# EAGLE design 1_Main (EAGLE 7.7.0)
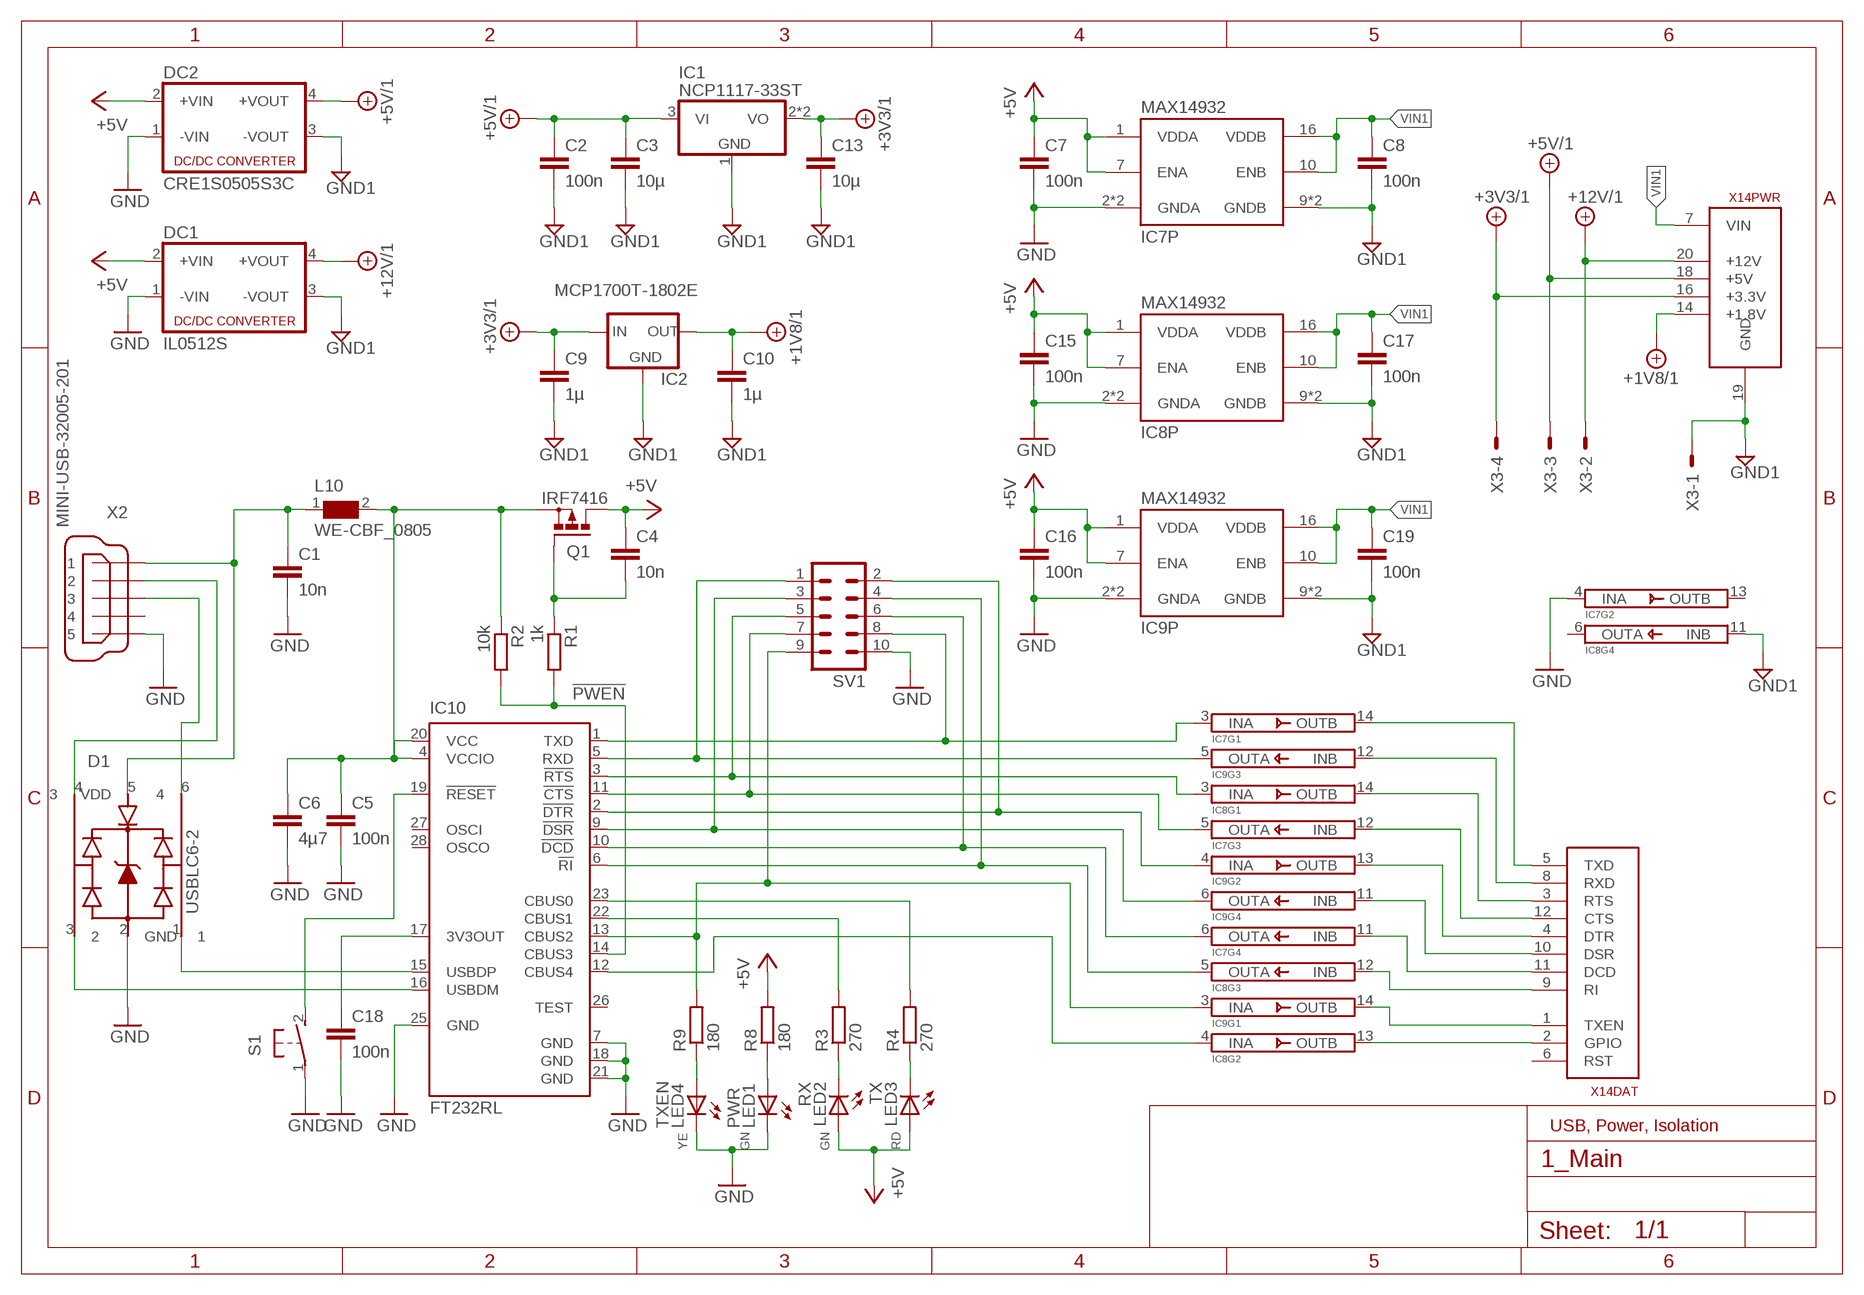
[diagram p0: schematic, sheet 1]

## Parts
C1  10n  C-EUC0805  [C0805]
C2  100n  C-EUC0805  [C0805]
C3  10µ  C-EUC0805  [C0805]
C4  10n  C-EUC0805  [C0805]
C5  100n  C-EUC0805  [C0805]
C6  4µ7  C-EUC0805  [C0805]
C7  100n  C-EUC0805  [C0805]
C8  100n  C-EUC0805  [C0805]
C9  1µ  C-EUC0805  [C0805]
C10  1µ  C-EUC0805  [C0805]
C13  10µ  C-EUC0805  [C0805]
C15  100n  C-EUC0805  [C0805]
C16  100n  C-EUC0805  [C0805]
C17  100n  C-EUC0805  [C0805]
C18  100n  C-EUC0805  [C0805]
C19  100n  C-EUC0805  [C0805]
D1  USBLC6-2  WE-TVS_82400102  [WE-TVS_SOT23-6L]
DC1  IL0512S  NME  [NME]
DC2  CRE1S0505S3C  NME  [NME]
IC1  NCP1117-33ST  [SOT223]
IC2  MCP1700T-1802E  MCP170X  [SOT23]
IC7  MAX14932  [SO16]
IC8  MAX14932  [SO16]
IC9  MAX14932  [SO16]
IC10  FT232RL  [SSOP28]
L10  WE-CBF_0805  [0805]
LED1  PWR  LEDCHIPLED_0603  [CHIPLED_0603]
LED2  RX  LEDCHIPLED_0603  [CHIPLED_0603]
LED3  TX  LEDCHIPLED_0603  [CHIPLED_0603]
LED4  TXEN  LEDCHIPLED_0603  [CHIPLED_0603]
Q1  IRF7416  P-MOSFET-SO8  [SO-08]
R1  1k  R-EU_R0805  [R0805]
R2  10k  R-EU_R0805  [R0805]
R3  270  R-EU_R0805  [R0805]
R4  270  R-EU_R0805  [R0805]
R8  180  R-EU_R0805  [R0805]
R9  180  R-EU_R0805  [R0805]
S1  31-XX  [B3F-31XX]
SV1  ML10  [ML10]
X2  MINI-USB-32005-201  [32005-201]
X3  AKL18X-04W  [AKL182-04]
X14  ALLSERIALMM  [MAIN-THT]

## Nets
!PWEN: IC10.14(CBUS3) R1.2 R2.2
+1V8/1: C10.1 IC2.2(OUT) X14.14(PWR:+1.8V)
+3V3/1: C9.1 C13.1 IC1.2(VO) IC1.4(VO) IC2.3(IN) X3.P$4 X14.16(PWR:+3.3V)
+5V: C4.1 C7.1 C15.1 C16.1 DC1.2(+VIN) DC2.2(+VIN) IC7.1(P:VDDA) IC7.7(P:ENA) IC8.1(P:VDDA) IC8.7(P:ENA) IC9.1(P:VDDA) IC9.7(P:ENA) LED2.A LED3.A Q1.5(D) Q1.6(D) Q1.7(D) Q1.8(D) R8.2
+5V/1: C2.1 C3.1 DC2.4(+VOUT) IC1.3(VI) X3.P$3 X14.18(PWR:+5V)
+12V/1: DC1.4(+VOUT) X3.P$2 X14.20(PWR:+12V)
GND: C1.2 C5.2 C6.2 C7.2 C15.2 C16.2 C18.2 D1.2(GND) DC1.1(-VIN) DC2.1(-VIN) IC7.2(P:GNDA) IC7.4(INA) IC7.8(P:GNDA) IC8.2(P:GNDA) IC8.8(P:GNDA) IC9.2(P:GNDA) IC9.8(P:GNDA) IC10.7(GND) IC10.18(GND) IC10.21(GND) IC10.25(GND) LED1.C LED4.C S1.1(P) SV1.10 X2.5
GND1: C2.2 C3.2 C8.2 C9.2 C10.2 C13.2 C17.2 C19.2 DC1.3(-VOUT) DC2.3(-VOUT) IC1.1(GND) IC2.1(GND) IC7.9(P:GNDB) IC7.15(P:GNDB) IC8.9(P:GNDB) IC8.11(INB) IC8.15(P:GNDB) IC9.9(P:GNDB) IC9.15(P:GNDB) X3.P$1 X14.19(PWR:GND)
N$1: IC9.5(OUTA) IC10.5(RXD) SV1.1
N$2: IC9.6(OUTA) IC10.9(!DSR) SV1.3
N$3: IC9.3(INA) IC10.13(CBUS2) R9.2 SV1.9
N$4: LED3.C R4.1
N$5: IC10.19(!RESET) S1.2(S)
N$6: LED2.C R3.1
N$7: LED4.A R9.1
N$8: LED1.A R8.1
N$9: D1.3 IC10.16(USBDM)
N$10: D1.1 IC10.15(USBDP)
N$11: C1.1 D1.5(VDD) L10.1 X2.1
N$12: D1.4 X2.2
N$13: IC8.4(INA) IC10.12(CBUS4)
N$14: IC7.3(INA) IC10.1(TXD) SV1.8
N$15: D1.6 X2.3
N$22: C18.1 IC10.17(3V3OUT)
N$29: IC8.3(INA) IC10.3(!RTS) SV1.5
N$32: IC7.5(OUTA) IC10.11(!CTS) SV1.7
N$33: IC9.4(INA) IC10.2(!DTR) SV1.2
N$35: IC7.6(OUTA) IC10.10(!DCD) SV1.6
N$36: IC8.5(OUTA) IC10.6(!RI) SV1.4
N$38: C5.1 C6.1 IC10.4(VCCIO) IC10.20(VCC) L10.2 Q1.1(S) Q1.2(S) Q1.3(S) R2.1
N$42: C4.2 Q1.4(G) R1.1
N$80: IC7.14(OUTB) X14.5(DAT:TXD)
N$81: IC9.12(INB) X14.8(DAT:RXD)
N$82: IC8.14(OUTB) X14.3(DAT:RTS)
N$83: IC7.12(INB) X14.12(DAT:CTS)
N$84: IC9.13(OUTB) X14.4(DAT:DTR)
N$85: IC9.11(INB) X14.10(DAT:DSR)
N$86: IC7.11(INB) X14.11(DAT:DCD)
N$87: IC8.12(INB) X14.9(DAT:RI)
N$88: IC9.14(OUTB) X14.1(DAT:TXEN)
N$89: IC8.13(OUTB) X14.2(DAT:GPIO)
RXLED: IC10.22(CBUS1) R3.2
TXLED: IC10.23(CBUS0) R4.2
VIN1: C8.1 C17.1 C19.1 IC7.10(P:ENB) IC7.16(P:VDDB) IC8.10(P:ENB) IC8.16(P:VDDB) IC9.10(P:ENB) IC9.16(P:VDDB) X14.7(PWR:VIN)
Unconnected: IC7.13(OUTB) IC8.6(OUTA) IC10.26(TEST) IC10.27(OSCI) IC10.28(OSCO) X2.4 X14.6(DAT:RST) X14.13(USB:VUSB) X14.15(USB:D+) X14.17(USB:D-)

## Notes on the sheet
- USB, Power, Isolation

## Library data of the parts
C1-C10 C13 C15-C19 = rcl:C-EU: CAPACITOR, European symbol
D1 = EagleLibrary_Wuerth_Elektronik_eiSos_Version_6-9:WE-TVS_82400102: TVS Diode Array WE-TVS, High Speed Series - Low capazity - No leakage current - Low clamping voltage - high ESD voltage protection -- USB 1.0 - 2.0 Flow Thru Design
DC1 DC2 = dc-dc-converter:NME: DC-DC CONVERTER; MF: C & D TECHNOLOGIES, INC; MPN: NME1205D; OC_FARNELL: 1021466; OC_NEWARK: 98B8198
IC1 = linear:NCP1117
IC2 = SeeSys:MCP170X
IC7-IC9 = max14932:MAX14932
IC10 = ftdichip:FT232R: Source: http://www.ftdichip.com/Documents/DataSheets/DS_FT232R_v104.pdf; MPN: FT232RL; OC_FARNELL: 1146032; OC_NEWARK: 91K9918
L10 = EagleLibrary_Wuerth_Elektronik_eiSos_Version_6-12:WE-CBF: SMD EMI Suppression Ferrite Beads WE-CBF - Excellent anti-EMI properties - Low DC-restistance - Impedances till 3000 ohms - Rated current up to 6 A -- Reliable Ni-Sn electrodes -- Perfect as data lined filter and for uncoupling of distribution voltage
LED1 LED2 = led:LED: LED OSRAM: - CHIPLED LG R971, LG N971, LY N971, LG Q971, LY Q971, LO R971, LY R971 LH N974, LH R974 LS Q976, LO Q976, LY Q976 LO Q996 - Hyper CHIPLED LW Q18S LB Q993, LB Q99A, LB R99A - SideLED LS A670, LO A670, LY A670, LG A670, LP A670 LB A673, LV A673, LT A673, LW A673 LH A674 LY A675 LS A676, LA A676, LO A676, LY A676, LW A676 LS A679, LY A679, LG A679 - Hyper Micro SIDELED® LS Y876, LA Y876, LO Y876, LY Y876 LT Y87S - SmartLED LW L88C, LW L88S LB L89C, LB L89S, LG L890 LS L89K, LO L89K, LY L89K LS L896, LA L896, LO L896, LY L896 - TOPLED LS T670, LO T670, LY T670, LG T670, LP T670 LSG T670, LSP T670, LSY T670, LOP T670, LYG T670 LG T671, LOG T671, LSG T671 LB T673, LV T673, LT T673, LW T673 LH T674 LS T676, LA T676, LO T676, LY T676, LB T676, LH T676, LSB T676, LW T676 LB T67C, LV T67C, LT T67C, LS T67K, LO T67K, LY T67K, LW E67C LS E67B, LA E67B, LO E67B, LY E67B, LB E67C, LV E67C, LT E67C LW T67C LS T679, LY T679, LG T679 LS T770, LO T770, LY T770, LG T770, LP T770 LB T773, LV T773, LT T773, LW T773 LH T774 LS E675, LA E675, LY E675, LS T675 LS T776, LA T776, LO T776, LY T776, LB T776 LHGB T686 LT T68C, LB T68C - Hyper Mini TOPLED® LB M676 - Mini TOPLED Santana® LG M470 LS M47K, LO M47K, LY M47K Source: http://www.osram.convergy.de LUXEON: - LUMILED® LXK2-PW12-R00, LXK2-PW12-S00, LXK2-PW14-U00, LXK2-PW14-V00 LXK2-PM12-R00, LXK2-PM12-S00, LXK2-PM14-U00 LXK2-PE12-Q00, LXK2-PE12-R00, LXK2-PE12-S00, LXK2-PE14-T00, LXK2-PE14-U00 LXK2-PB12-K00, LXK2-PB12-L00, LXK2-PB12-M00, LXK2-PB14-N00, LXK2-PB14-P00, LXK2-PB14-Q00 LXK2-PR12-L00, LXK2-PR12-M00, LXK2-PR14-Q00, LXK2-PR14-R00 LXK2-PD12-Q00, LXK2-PD12-R00, LXK2-PD12-S00 LXK2-PH12-R00, LXK2-PH12-S00 LXK2-PL12-P00, LXK2-PL12-Q00, LXK2-PL12-R00 Source: www.luxeon.com KINGBRIGHT: KA-3528ASYC Source: www.kingbright.com; COLOR: GN
LED3 = led:LED: LED OSRAM: - CHIPLED LG R971, LG N971, LY N971, LG Q971, LY Q971, LO R971, LY R971 LH N974, LH R974 LS Q976, LO Q976, LY Q976 LO Q996 - Hyper CHIPLED LW Q18S LB Q993, LB Q99A, LB R99A - SideLED LS A670, LO A670, LY A670, LG A670, LP A670 LB A673, LV A673, LT A673, LW A673 LH A674 LY A675 LS A676, LA A676, LO A676, LY A676, LW A676 LS A679, LY A679, LG A679 - Hyper Micro SIDELED® LS Y876, LA Y876, LO Y876, LY Y876 LT Y87S - SmartLED LW L88C, LW L88S LB L89C, LB L89S, LG L890 LS L89K, LO L89K, LY L89K LS L896, LA L896, LO L896, LY L896 - TOPLED LS T670, LO T670, LY T670, LG T670, LP T670 LSG T670, LSP T670, LSY T670, LOP T670, LYG T670 LG T671, LOG T671, LSG T671 LB T673, LV T673, LT T673, LW T673 LH T674 LS T676, LA T676, LO T676, LY T676, LB T676, LH T676, LSB T676, LW T676 LB T67C, LV T67C, LT T67C, LS T67K, LO T67K, LY T67K, LW E67C LS E67B, LA E67B, LO E67B, LY E67B, LB E67C, LV E67C, LT E67C LW T67C LS T679, LY T679, LG T679 LS T770, LO T770, LY T770, LG T770, LP T770 LB T773, LV T773, LT T773, LW T773 LH T774 LS E675, LA E675, LY E675, LS T675 LS T776, LA T776, LO T776, LY T776, LB T776 LHGB T686 LT T68C, LB T68C - Hyper Mini TOPLED® LB M676 - Mini TOPLED Santana® LG M470 LS M47K, LO M47K, LY M47K Source: http://www.osram.convergy.de LUXEON: - LUMILED® LXK2-PW12-R00, LXK2-PW12-S00, LXK2-PW14-U00, LXK2-PW14-V00 LXK2-PM12-R00, LXK2-PM12-S00, LXK2-PM14-U00 LXK2-PE12-Q00, LXK2-PE12-R00, LXK2-PE12-S00, LXK2-PE14-T00, LXK2-PE14-U00 LXK2-PB12-K00, LXK2-PB12-L00, LXK2-PB12-M00, LXK2-PB14-N00, LXK2-PB14-P00, LXK2-PB14-Q00 LXK2-PR12-L00, LXK2-PR12-M00, LXK2-PR14-Q00, LXK2-PR14-R00 LXK2-PD12-Q00, LXK2-PD12-R00, LXK2-PD12-S00 LXK2-PH12-R00, LXK2-PH12-S00 LXK2-PL12-P00, LXK2-PL12-Q00, LXK2-PL12-R00 Source: www.luxeon.com KINGBRIGHT: KA-3528ASYC Source: www.kingbright.com; COLOR: RD
LED4 = led:LED: LED OSRAM: - CHIPLED LG R971, LG N971, LY N971, LG Q971, LY Q971, LO R971, LY R971 LH N974, LH R974 LS Q976, LO Q976, LY Q976 LO Q996 - Hyper CHIPLED LW Q18S LB Q993, LB Q99A, LB R99A - SideLED LS A670, LO A670, LY A670, LG A670, LP A670 LB A673, LV A673, LT A673, LW A673 LH A674 LY A675 LS A676, LA A676, LO A676, LY A676, LW A676 LS A679, LY A679, LG A679 - Hyper Micro SIDELED® LS Y876, LA Y876, LO Y876, LY Y876 LT Y87S - SmartLED LW L88C, LW L88S LB L89C, LB L89S, LG L890 LS L89K, LO L89K, LY L89K LS L896, LA L896, LO L896, LY L896 - TOPLED LS T670, LO T670, LY T670, LG T670, LP T670 LSG T670, LSP T670, LSY T670, LOP T670, LYG T670 LG T671, LOG T671, LSG T671 LB T673, LV T673, LT T673, LW T673 LH T674 LS T676, LA T676, LO T676, LY T676, LB T676, LH T676, LSB T676, LW T676 LB T67C, LV T67C, LT T67C, LS T67K, LO T67K, LY T67K, LW E67C LS E67B, LA E67B, LO E67B, LY E67B, LB E67C, LV E67C, LT E67C LW T67C LS T679, LY T679, LG T679 LS T770, LO T770, LY T770, LG T770, LP T770 LB T773, LV T773, LT T773, LW T773 LH T774 LS E675, LA E675, LY E675, LS T675 LS T776, LA T776, LO T776, LY T776, LB T776 LHGB T686 LT T68C, LB T68C - Hyper Mini TOPLED® LB M676 - Mini TOPLED Santana® LG M470 LS M47K, LO M47K, LY M47K Source: http://www.osram.convergy.de LUXEON: - LUMILED® LXK2-PW12-R00, LXK2-PW12-S00, LXK2-PW14-U00, LXK2-PW14-V00 LXK2-PM12-R00, LXK2-PM12-S00, LXK2-PM14-U00 LXK2-PE12-Q00, LXK2-PE12-R00, LXK2-PE12-S00, LXK2-PE14-T00, LXK2-PE14-U00 LXK2-PB12-K00, LXK2-PB12-L00, LXK2-PB12-M00, LXK2-PB14-N00, LXK2-PB14-P00, LXK2-PB14-Q00 LXK2-PR12-L00, LXK2-PR12-M00, LXK2-PR14-Q00, LXK2-PR14-R00 LXK2-PD12-Q00, LXK2-PD12-R00, LXK2-PD12-S00 LXK2-PH12-R00, LXK2-PH12-S00 LXK2-PL12-P00, LXK2-PL12-Q00, LXK2-PL12-R00 Source: www.luxeon.com KINGBRIGHT: KA-3528ASYC Source: www.kingbright.com; COLOR: YE
Q1 = transistor-power:P-MOSFET-SO8: P-Channel MOSFET Example: FDS4435A; P-Channel Logic Level PowerTrench® MOSFET FDS4465; P-Channel 1.8V Specified PowerTrench® MOSFET Source: www.fairchildsemi.com
R1-R4 R8 R9 = rcl:R-EU_: RESISTOR, European symbol
S1 = switch-omron:31-XX: OMRON SWITCH; MPN: B3F-3100; OC_FARNELL: 959704; OC_NEWARK: 36M3582
SV1 = con-harting-ml:ML10: HARTING; OC_FARNELL: unknown; OC_NEWARK: unknown
X2 = con-cypressindustries:MINI-USB-: MINI USB-B Conector Source: www.cypressindustries.com; OC_FARNELL: unknown; OC_NEWARK: unknown
X3 = con-riacon_akl:AKL18X-04: Riacon AKL18X Steckverbinder 4-Pol Grid = 3,5mm
X14 = AllSerial:ALLSERIAL

## Board
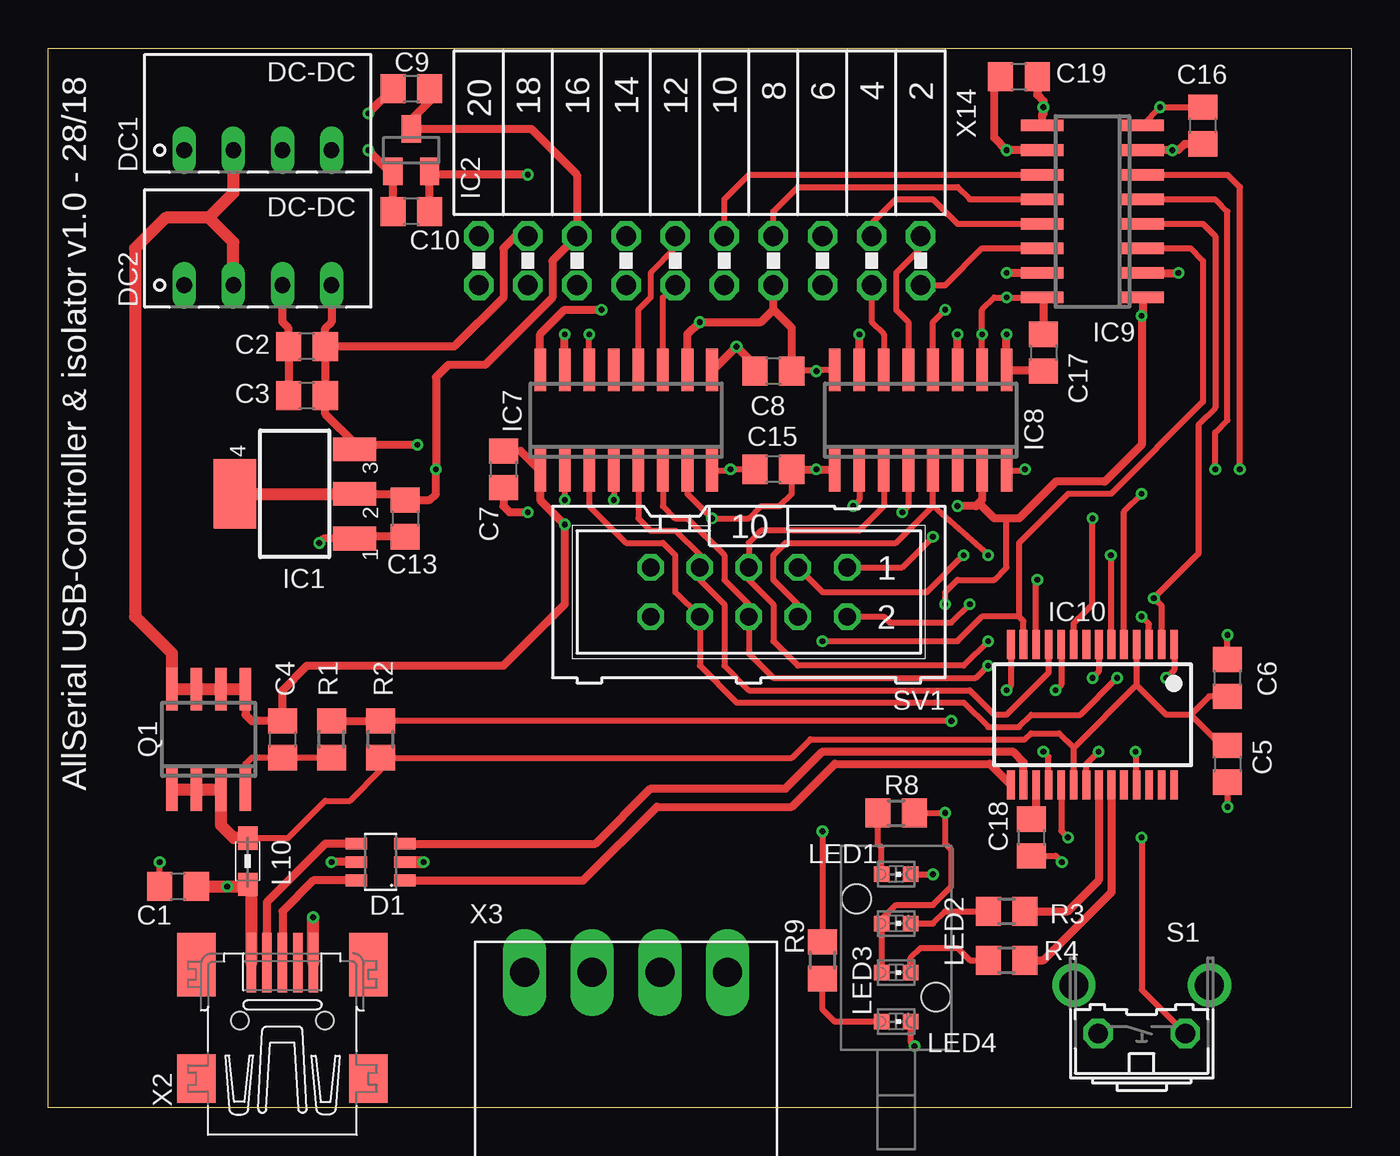
[diagram p1: board, top side]
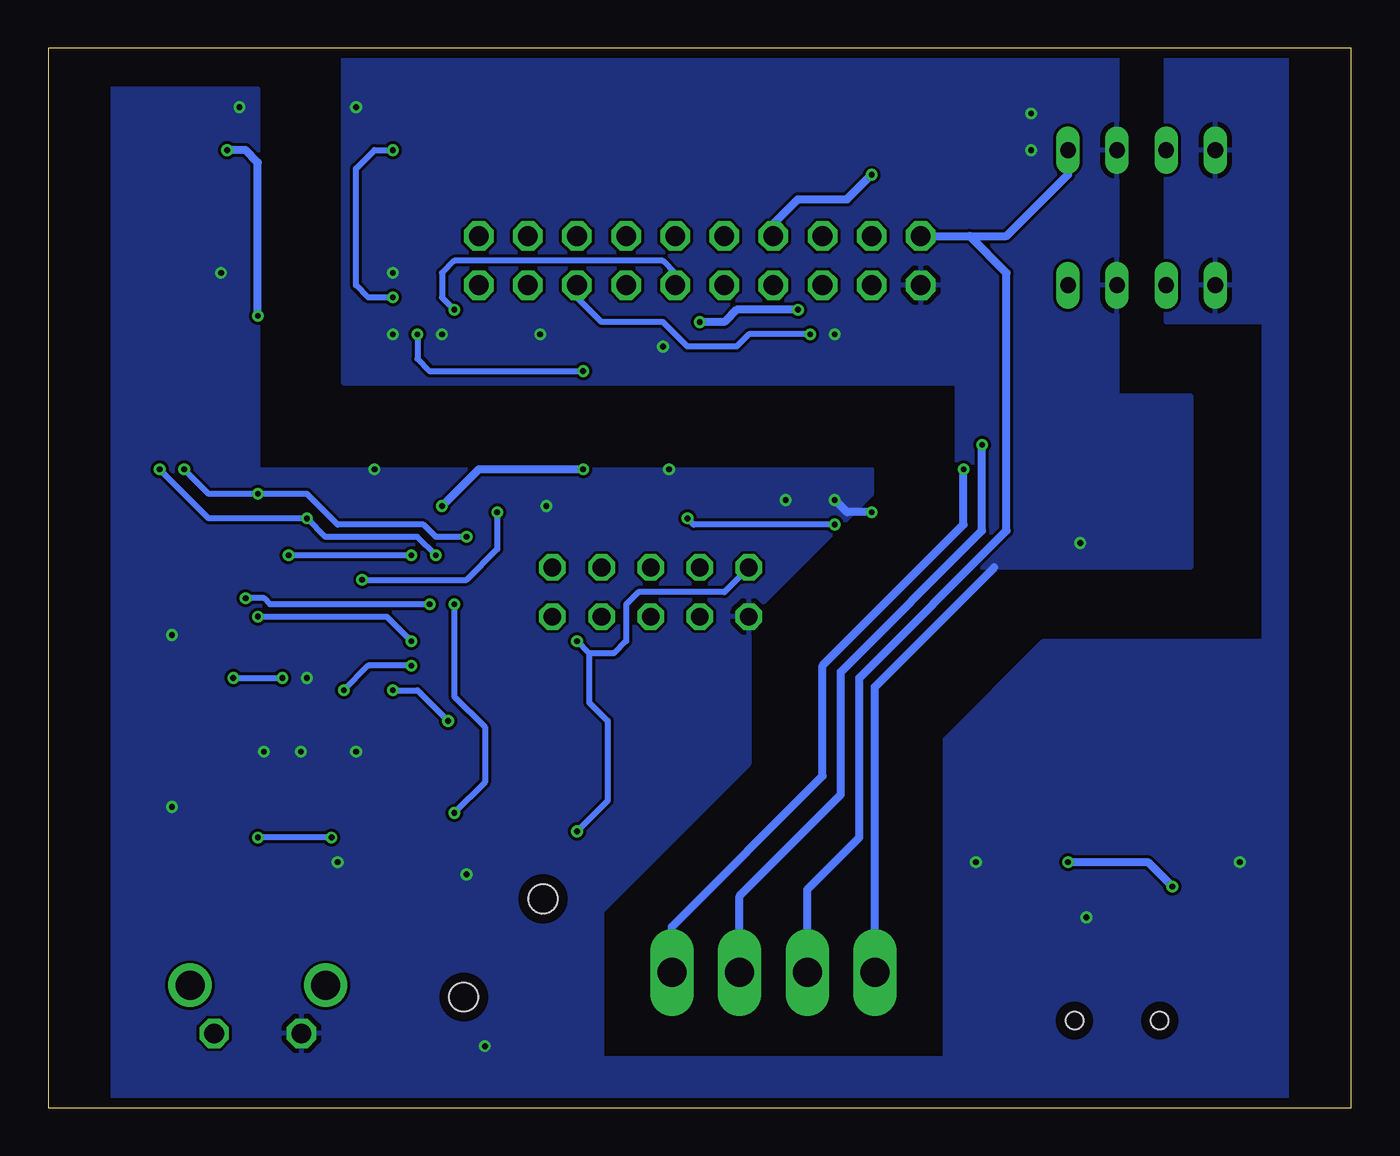
[diagram p2: board, bottom side, seen from below]

Size 67.4 x 54.8 mm. Coordinates in mm from the lower left corner, seen from the top.
Copper layers (1*16): Top 0.035mm / dielectric 1.6mm / Bottom 0.035mm
Design rules "Elecrow_2-layer_PCB_eagle_rule *": minimum track width 6mil, minimum drill 0.3mm, track to track 6mil, track to pad 6mil, pad to pad 6mil, via to via 8mil, smd to smd 0mil, copper to edge 20mil, drill to drill 10mil, minimum pad ring 6mil, minimum via ring 6mil, stop-mask expansion 0mil, vias tented up to drill 100mil, thermal gap 10mil

### Footprints (pad centres in the part's own frame; a part is rotated, then mirrored left to right if it is on the bottom)
C0805 = smd 1.3 x 1.5: 1 -0.95,0; 2 0.95,0
WE-TVS_SOT23-6L = smd 0.6 x 1.1: 1 -0.95,-1.25; 2 0,-1.25; 3 0.95,-1.25; 4 0.95,1.25; 5 0,1.25; 6 -0.95,1.25
NME = drill 0.813 long: 1 0,3.81; 2 0,1.27; 3 0,-1.27; 4 0,-3.81
SOT223 = smd 1.219 x 2.235: 1 -2.311,-3.099; 2 0,-3.099; 3 2.311,-3.099 | smd 3.6 x 2.2: 4 0,3.099
SOT23 = smd 1 x 1.4: 1 -0.95,-1.1; 2 0.95,-1.1; 3 0,1.1
SO16 = smd 0.6 x 2.2: 1 -4.445,-2.6; 2 -3.175,-2.6; 3 -1.905,-2.6; 4 -0.635,-2.6; 5 0.635,-2.6; 6 1.905,-2.6; 7 3.175,-2.6; 8 4.445,-2.6; 9 4.445,2.6; 10 3.175,2.6; 11 1.905,2.6; 12 0.635,2.6; 13 -0.635,2.6; 14 -1.905,2.6; 15 -3.175,2.6; 16 -4.445,2.6
SSOP28 = smd 0.4 x 1.5: 1 -4.225,-3.625; 2 -3.575,-3.625; 3 -2.925,-3.625; 4 -2.275,-3.625; 5 -1.625,-3.625; 6 -0.975,-3.625; 7 -0.325,-3.625; 8 0.325,-3.625; 9 0.975,-3.625; 10 1.625,-3.625; 11 2.275,-3.625; 12 2.925,-3.625; 13 3.575,-3.625; 14 4.225,-3.625; 15 4.225,3.625; 16 3.575,3.625; 17 2.925,3.625; 18 2.275,3.625; 19 1.625,3.625; 20 0.975,3.625; 21 0.325,3.625; 22 -0.325,3.625; 23 -0.975,3.625; 24 -1.625,3.625; 25 -2.275,3.625; 26 -2.925,3.625; 27 -3.575,3.625; 28 -4.225,3.625
0805 = smd 1.2 x 1: 1 -1.2,0; 2 1.2,0
CHIPLED_0603 = smd 0.8 x 0.8: A 0,-0.75; C 0,0.75
SO-08 = smd 0.6 x 2.2: 1 -1.905,-2.6; 2 -0.635,-2.6; 3 0.635,-2.6; 4 1.905,-2.6; 5 1.905,2.6; 6 0.635,2.6; 7 -0.635,2.6; 8 -1.905,2.6
R0805 = smd 1.3 x 1.5: 1 -0.95,0; 2 0.95,0
B3F-31XX = drill 1.016 octagon: 1 -2.261,-1.245; 2 2.261,-1.245 | drill 1.499 pad 2.159: 3 -3.505,1.245; 4 3.505,1.245
ML10 = drill 0.914 octagon: 1 -5.08,-1.27; 2 -5.08,1.27; 3 -2.54,-1.27; 4 -2.54,1.27; 5 0,-1.27; 6 0,1.27; 7 2.54,-1.27; 8 2.54,1.27; 9 5.08,-1.27; 10 5.08,1.27
1296.1004 = hole 1.5: 2.05,-2.54; -2.05,2.54
32005-201 = smd 3.1 x 0.5: 1 3,1.6; 2 3,0.8; 3 3,0; 4 3,-0.8; 5 3,-1.6 | smd 2.5 x 2: M1 -3,-4.45; M2 -3,4.45 | smd 3.3 x 2: M3 2.9,4.45; M4 2.9,-4.45 | hole 0.9: 0,2.2; 0,-2.2
AKL182-04 = drill 1.5 pad 2.184 long: P$1 -5.25,0; P$2 -1.75,0; P$3 1.75,0; P$4 5.25,0
MAIN-THT = drill 1.016 octagon: 1 11.43,42.545; 2 11.43,45.085; 3 8.89,42.545; 4 8.89,45.085; 5 6.35,42.545; 6 6.35,45.085; 7 3.81,42.545; 8 3.81,45.085; 9 1.27,42.545; 10 1.27,45.085; 11 -1.27,42.545; 12 -1.27,45.085; 13 -3.81,42.545; 14 -3.81,45.085; 15 -6.35,42.545; 16 -6.35,45.085; 17 -8.89,42.545; 18 -8.89,45.085; 19 -11.43,42.545; 20 -11.43,45.085

### Placement (x,y rotation side)
C1  6.71,11.43 180 top
C2  13.38,39.37 180 top
C3  13.38,36.83 180 top
C4  12.11,19.05 270 top
C5  61.01,17.78 270 top
C6  61.01,22.23 90 top
C7  23.54,33.02 270 top
C8  37.51,38.1 180 top
C9  18.78,52.7 180 top
C10  18.78,46.35 180 top
C13  18.46,30.48 270 top
C15  37.51,33.02 180 top
C16  59.73,50.8 90 top
C17  51.48,39.05 270 top
C18  50.84,13.97 270 top
C19  50.21,53.34 0 top
D1  17.19,12.7 90 top
DC1  10.84,49.53 90 top
DC2  10.84,42.55 90 top
IC1  12.75,31.75 90 top
IC2  18.78,49.53 0 top
IC7  29.89,35.56 0 top
IC8  45.13,35.56 0 top
IC9  54.02,46.35 90 top
IC10  54.02,20.32 180 top
L10  10.32,12.74 90 top
LED1  43.86,12.06 270 top
LED2  43.86,9.53 270 top
LED3  43.86,6.99 270 top
LED4  43.86,4.45 270 top
Q1  8.3,19.05 0 top
R1  14.65,19.05 90 top
R2  17.19,19.05 90 top
R3  49.58,10.16 0 top
R4  49.58,7.62 0 top
R8  43.86,15.24 0 top
R9  40.05,7.62 90 top
S1  56.56,5.08 0 top
SV1  36.24,26.67 180 top
U$3  [1296.1004]  43.86,8.26 180 top
X2  12.11,4.5 90 top
X3  29.89,6.99 0 top
X14  33.7,0 0 top

### Tracks (layer width: path | path; a pad name or v marks a point on that pad's centre or on a via)
!PWEN  (via drill 0.3)
  Top 0.305: IC10.14 49.8,21.81 v49.58,21.59 | v46.72,20 R2.2
  Top 0.406: R1.2 R2.2
  Bottom 0.305: v49.58,21.59 48.31,21.59 v46.72,20
+1V8/1  (via drill 0.3)
  Top 0.406: C10.1 IC2.2 19.9,48.26 v24.81,48.26
  Bottom 0.406: X14.14 29.89,45.72 28.62,46.99 26.08,46.99 v24.81,48.26
+3V3/1  (via drill 0.3)
  Top 0.406: IC1.2 18.14,31.75 C13.1 19.73,31.43 20.05,31.75 v20.05,33.02 20.05,37.78 20.68,38.42 22.59,38.42 26.08,41.91 26.08,43.81 X14.16 27.35,48.26 24.98,50.63 IC2.3 18.78,51.12 19.73,52.07 C9.1
  Top 0.61: IC1.4 IC1.2
  Bottom 0.406: X3.P$4 35.14,9.36 27.35,17.14 27.35,22.86 20.05,30.16 v20.05,33.02
+5V  (via drill 0.3)
  Top 0.305: IC7.7 33.07,31.75 v34.34,30.48 36.24,30.48 36.88,31.11 37.83,31.11 38.46,31.75 C15.1 | LED3.A LED2.A 43.11,9.73 43.86,10.48 45.77,10.48 46.72,11.43 46.72,13.34 46.4,13.65 v46.4,15.24 R8.2 | v46.4,26.04 46.4,26.67 47.04,27.3 48.94,27.3 49.58,27.94 49.58,30.48
  Top 0.406: Q1.5 10.21,20.32 10.53,20 C4.1 12.11,21.59 13.38,22.86 23.54,22.86 26.72,26.04 v26.72,30.16 25.45,31.43 IC7.1 | C16.1 58.79,49.85 58.47,49.53 v58.15,49.53 IC9.7 | 25.39,33.02 IC7.1 | C15.1 v39.73,33.02 40.62,33.02 IC8.1 | IC8.7 48.31,31.43 48.15,31.27 | 48.15,31.27 47.99,31.11 v47.04,31.11 | IC9.1 56.62,41.02 v56.56,40.96 56.56,34.29 54.66,32.38 52.12,32.38 50.21,30.48 49.58,30.48 48.94,30.48 48.15,31.27 | C7.1 24.44,33.97 IC7.1
  Top 0.61: Q1.5 Q1.6 Q1.7 Q1.8 6.4,23.5 4.49,25.4 4.49,44.45 6.08,46.04 8.3,46.04 | DC1.2 9.57,47.31 8.3,46.04 | DC2.2 9.57,44.77 8.3,46.04
  Bottom 0.305: v26.72,30.16 34.02,30.16 v34.34,30.48 | v46.4,26.04 46.4,21.27 44.81,19.68 44.81,16.83 v46.4,15.24
  Bottom 0.406: v39.73,33.02 45.13,33.02 v47.04,31.11 | v56.56,40.96 56.56,48.9 57.2,49.53 v58.15,49.53
+5V/1  (via drill 0.3)
  Top 0.406: X14.18 24.18,45.09 23.54,44.45 23.54,41.91 21,39.37 C2.1 | IC1.3 16.07,34.29 | 16.07,34.29 v19.1,34.29 | C2.1 C3.1 14.33,35.88 15.92,34.29 16.07,34.29 | DC2.4 14.65,40.64 14.33,40.32 C2.1
  Bottom 0.406: X3.P$3 31.64,10.95 26.4,16.19 26.4,22.54 19.1,29.84 v19.1,34.29
+12V/1
  Bottom 0.406: X3.P$2 28.14,11.28 25.45,13.97 25.45,22.23 17.83,29.84 17.83,43.18 19.73,45.09 | X14.20 19.73,45.09 | 19.73,45.09 17.83,45.09 14.65,48.26 DC1.4
GND  (via drill 0.3)
  Top 0.305: C1.2 v5.76,12.7 | LED4.C 44.61,3.38 v44.81,3.17 | LED1.C v45.77,12.06 | C18.2 52.11,13.02 v52.43,12.7 | C5.2 v61.01,15.56 | C6.2 v61.01,24.45 | IC10.7 54.34,22.55 v54.02,22.23 | IC7.8 35.23,32.96 v35.29,33.02 C15.2 | IC8.2 41.96,31.43 v41.64,31.11 | IC8.8 50.47,32.96 v50.53,33.02 | IC9.8 56.62,50.86 v57.51,51.75 C16.2 | IC10.18 51.75,18.15 v51.48,18.41 | IC10.21 53.7,17.77 v54.34,18.41 | IC10.25 56.3,18.36 v56.24,18.41 | IC7.2 v26.72,31.43 | IC7.4 v29.26,31.43
  Top 0.406: IC9.2 v58.47,43.18 | C7.2 23.54,31.11 23.86,30.8 v24.81,30.8
  Top 0.61: X2.5 v13.71,9.83 v13.7,9.84 | D1.2 v19.41,12.7
  Bottom 0.406: v24.81,30.8 26.08,30.8 v26.72,31.43
  pour Bottom: -0.59,0 68.55,0 68.31,52.7 56.56,52.7 56.56,33.02 24.81,33.02 24.81,31.75 31.16,25.4 31.16,17.78 38.78,10.16 38.78,2.54 21,2.54 21,19.05 15.92,24.13 4.49,24.13 4.49,40.64 9.57,40.64 9.57,54.95 -0.59,54.95
GND1  (via drill 0.3)
  Top 0.406: IC7.9 34.4,38.16 v35.61,39.37 36.56,38.41 C8.2 | IC7.15 v26.72,40.01 | IC8.15 v41.96,40.01 | IC8.11 v47.04,40.01 | v49.58,40.01 IC8.9 51.48,38.16 C17.2 | IC9.15 v49.58,43.18 | v14.02,29.21 14.24,29.44 IC1.1 15.94,29.53 C13.2 | C19.2 51.16,52.39 51.48,52.07 v51.48,51.75 51.48,51.44 51.42,51.38 IC9.9 | C9.2 v16.56,51.44 | C10.2 IC2.1 17.66,48.43 v16.56,49.53 | C3.2 C2.2 12.43,40.32 12.11,40.64 DC2.3
  Bottom 0.406: X3.P$1 24.64,21.76 18.46,27.94
  pour Bottom: 12.11,54.61 12.11,36.83 8.3,36.83 8.3,27.94 20.37,27.94 20.37,37.47 52.12,37.47 52.12,54.61
N$1  (via drill 0.3)
  Top 0.305: IC9.5 60.37,46.99 61.01,46.35 61.01,35.56 60.37,34.92 v60.37,33.02 | IC10.5 55.65,30.84 v56.56,31.75 | SV1.1 44.18,27.94 v45.77,29.53
  Bottom 0.305: v60.37,33.02 59.1,31.75 v56.56,31.75 54.02,31.75 52.43,30.16 47.99,30.16 47.35,29.53 v45.77,29.53
N$2  (via drill 0.3)
  Top 0.305: IC9.6 61.01,48.26 61.64,47.62 v61.64,33.02 | IC10.9 53.05,25.06 54.02,26.04 v54.02,30.48 | SV1.3 40.05,26.67 45.45,26.67 v47.35,28.57
  Bottom 0.305: v61.64,33.02 59.1,30.48 v54.02,30.48 53.07,29.53 48.31,29.53 v47.35,28.57
N$3  (via drill 0.3)
  Top 0.305: IC9.3 59.1,44.45 59.73,43.81 59.73,36.51 54.97,31.75 52.75,31.75 50.21,29.21 50.21,25.4 | IC10.13 50.45,25.16 50.21,25.4 | v40.05,24.13 47.04,24.13 48.31,25.4 50.21,25.4 | v40.05,14.29 R9.2
  Bottom 0.305: SV1.9 32.43,26.67 36.88,26.67 37.51,26.04 37.51,24.13 38.15,23.5 39.42,23.5 | 39.42,23.5 v40.05,24.13 | 39.42,23.5 39.42,20.95 38.46,20 38.46,15.88 v40.05,14.29
N$4
  Top 0.305: LED3.C 44.61,7.74 45.13,8.26 47.04,8.26 47.67,7.62 R4.1
N$5  (via drill 0.3)
  Top 0.305: IC10.19 52.4,14.32 v52.75,13.97 | v56.56,13.97 56.56,6.1 S1.2
  Bottom 0.305: v52.75,13.97 v56.56,13.97
N$6
  Top 0.305: LED2.C 45.77,9.53 46.4,10.16 R3.1
N$7
  Top 0.305: LED4.A 40.69,4.45 40.05,5.08 R9.1
N$8
  Top 0.305: LED1.A 43.11,13.45 42.91,13.65 R8.1
N$9
  Top 0.406: D1.3 28.3,13.65 31.16,16.51 38.15,16.51 40.05,18.41 49.89,18.41 50.45,17.86 IC10.16
N$10
  Top 0.406: D1.1 27.67,11.75 31.48,15.56 38.46,15.56 40.69,17.78 48.71,17.78 IC10.15
N$11  (via drill 0.3)
  Top 0.406: 10.51,11.35 L10.1 | D1.5 v14.65,12.7
  Top 0.61: C1.1 v9.25,11.43 10.21,11.43 L10.1 | X2.1 10.51,11.35
  Bottom 0.406: v14.65,12.7 10.52,12.7 v9.25,11.43
N$12
  Top 0.406: X2.2 11.31,10.63 14.33,13.65 D1.4
N$13  (via drill 0.3)
  Top 0.305: IC10.12 51.09,27.05 v51.16,27.3 | IC8.4 44.5,31.11 v44.18,30.8
  Bottom 0.305: v44.18,30.8 44.18,28.89 45.77,27.3 v51.16,27.3
N$14  (via drill 0.3)
  Top 0.305: IC10.1 58.25,22.64 v57.83,22.23 | IC7.3 27.99,31.11 29.89,29.21 31.8,29.21 32.43,28.57 32.43,26.67 SV1.8 33.7,22.86 35.61,20.95 47.35,20.95 48.62,19.68 50.21,19.68 50.84,20.32 53.39,20.32 v55.29,22.23
  Bottom 0.305: v57.83,22.23 v55.29,22.23
N$15
  Top 0.406: D1.6 13.7,11.75 12.11,10.16 X2.3
N$22
  Top 0.406: IC10.17 51.09,15.17 C18.1
N$29  (via drill 0.3)
  Top 0.305: IC8.3 43.23,31.11 41.96,29.84 36.88,29.84 36.24,29.21 SV1.5 36.24,27.3 37.51,26.04 37.51,24.13 38.78,22.86 47.35,22.86 v48.62,24.13 | IC10.3 56.95,25.02 v56.56,25.4
  Bottom 0.305: v56.56,25.4 49.89,25.4 v48.62,24.13
N$32
  Top 0.305: IC7.5 30.53,30.48 31.16,29.84 32.43,29.84 33.7,28.57 SV1.7 33.7,27.3 34.97,26.04 34.97,22.86 36.24,21.59 47.67,21.59 48.94,20.32 49.58,20.32 51.75,22.49 IC10.11
N$33  (via drill 0.3)
  Top 0.305: IC9.4 59.73,45.72 60.37,45.09 60.37,36.2 59.5,35.33 59.5,28.66 v57.2,26.35 57.59,25.95 IC10.2 | SV1.2 43.23,25.4 43.54,25.08 46.72,25.08 v47.67,26.04
  Bottom 0.305: v47.67,26.04 55.93,26.04 56.24,26.35 v57.2,26.35
N$35  (via drill 0.3)
  Top 0.305: IC7.6 31.8,31.11 32.43,30.48 33.07,30.48 34.97,28.57 34.97,27.3 36.24,26.04 SV1.6 36.24,23.5 37.51,22.23 47.99,22.23 v48.62,22.86 | IC10.10 52.4,21.87 v52.12,21.59
  Bottom 0.305: v48.62,22.86 50.84,22.86 v52.12,21.59
N$36  (via drill 0.3)
  Top 0.305: SV1.4 38.78,26.04 37.51,27.3 37.51,28.57 38.15,29.21 43.86,29.21 45.77,31.11 | 45.77,31.11 IC8.5 | IC10.6 55,28.55 v54.97,28.57 | 45.77,31.11 v48.62,28.57
  Bottom 0.305: v54.97,28.57 v48.62,28.57
N$38
  Top 0.305: C5.1 60.69,18.73 59.1,20.32 | C6.1 60.06,21.27 59.1,20.32 | 59.1,20.32 57.83,20.32 56.3,21.86 | IC10.4 56.3,21.86 | IC10.20 53.05,18.61 | 53.05,18.61 56.3,21.86 | L10.2 12.4,13.94 14.33,15.88 15.6,15.88 17.19,17.46 R2.1 38.47,18.1 39.42,19.05 50.53,19.05 50.84,19.37 52.28,19.37 53.05,18.61
  Top 0.61: Q1.1 Q1.2 Q1.3 8.94,14.61 9.6,13.94 L10.2
N$42
  Top 0.305: Q1.4 10.21,17.78 10.53,18.1 C4.2 R1.1
N$80  (via drill 0.3)
  Top 0.305: IC7.14 v27.99,40.01
  Bottom 0.305: v27.99,40.01 31.16,40.01 31.8,39.37 34.34,39.37 35.61,40.64 38.78,40.64 40.05,41.91 X14.5
N$81
  Top 0.305: X14.8 37.51,46.35 38.78,47.62 47.04,47.62 47.67,46.99 IC9.12
N$82
  Top 0.305: X14.3 42.59,40.64 43.23,40.01 IC8.14
N$83
  Top 0.305: X14.12 32.43,44.45 31.16,43.18 31.16,41.91 30.53,41.27 IC7.12
N$84
  Top 0.305: X14.4 42.59,45.72 43.86,46.99 45.77,46.99 47.04,45.72 IC9.13
N$85
  Top 0.305: X14.10 34.97,46.99 36.24,48.26 IC9.11
N$86
  Top 0.305: IC7.11 31.8,41.91 X14.11
N$87  (via drill 0.3)
  Top 0.305: IC8.12 45.77,40.64 v46.4,41.27
  Bottom 0.305: X14.9 34.97,43.18 35.61,43.81 46.4,43.81 47.04,43.18 47.04,41.91 v46.4,41.27
N$88
  Top 0.305: X14.1 46.4,42.55 48.31,44.45 IC9.14
N$89
  Top 0.305: X14.2 45.13,44.45 43.86,43.18 43.86,41.27 44.5,40.64 IC8.13
RXLED
  Top 0.406: R3.2 52.75,10.16 54.34,11.76 IC10.22
TXLED
  Top 0.406: R4.2 51.48,7.62 55,11.13 IC10.23
VIN1  (via drill 0.3)
  Top 0.305: IC8.10 v48.31,40.01 48.31,41.27 48.94,41.91 v49.58,41.91 IC9.16 | 38.52,38.16 39.67,38.16 v39.73,38.1 39.79,38.16 IC8.16
  Top 0.406: IC7.10 33.07,40.01 v33.7,40.64 36.88,40.64 37.51,41.27 | 37.51,41.27 X14.7 | 37.51,41.27 38.46,40.33 C8.1 38.52,38.16 | IC7.16 25.45,40.01 26.72,41.27 v28.62,41.27 | IC9.10 v49.58,49.53 48.94,50.16 48.94,53.02 C19.1 | IC9.16 51.48,41.91 C17.1
  Bottom 0.305: v49.58,41.91 50.84,41.91 51.48,42.55 51.48,48.58 50.53,49.53 v49.58,49.53 | v48.31,40.01 48.31,38.73 47.67,38.1 v39.73,38.1
  Bottom 0.406: v28.62,41.27 31.8,41.27 32.43,40.64 v33.7,40.64

### Text on the board
tPlace: AllSerial USB-Controller & isolator v1.0 - 28/18